# EAGLE design aspirin (EAGLE 6.1)
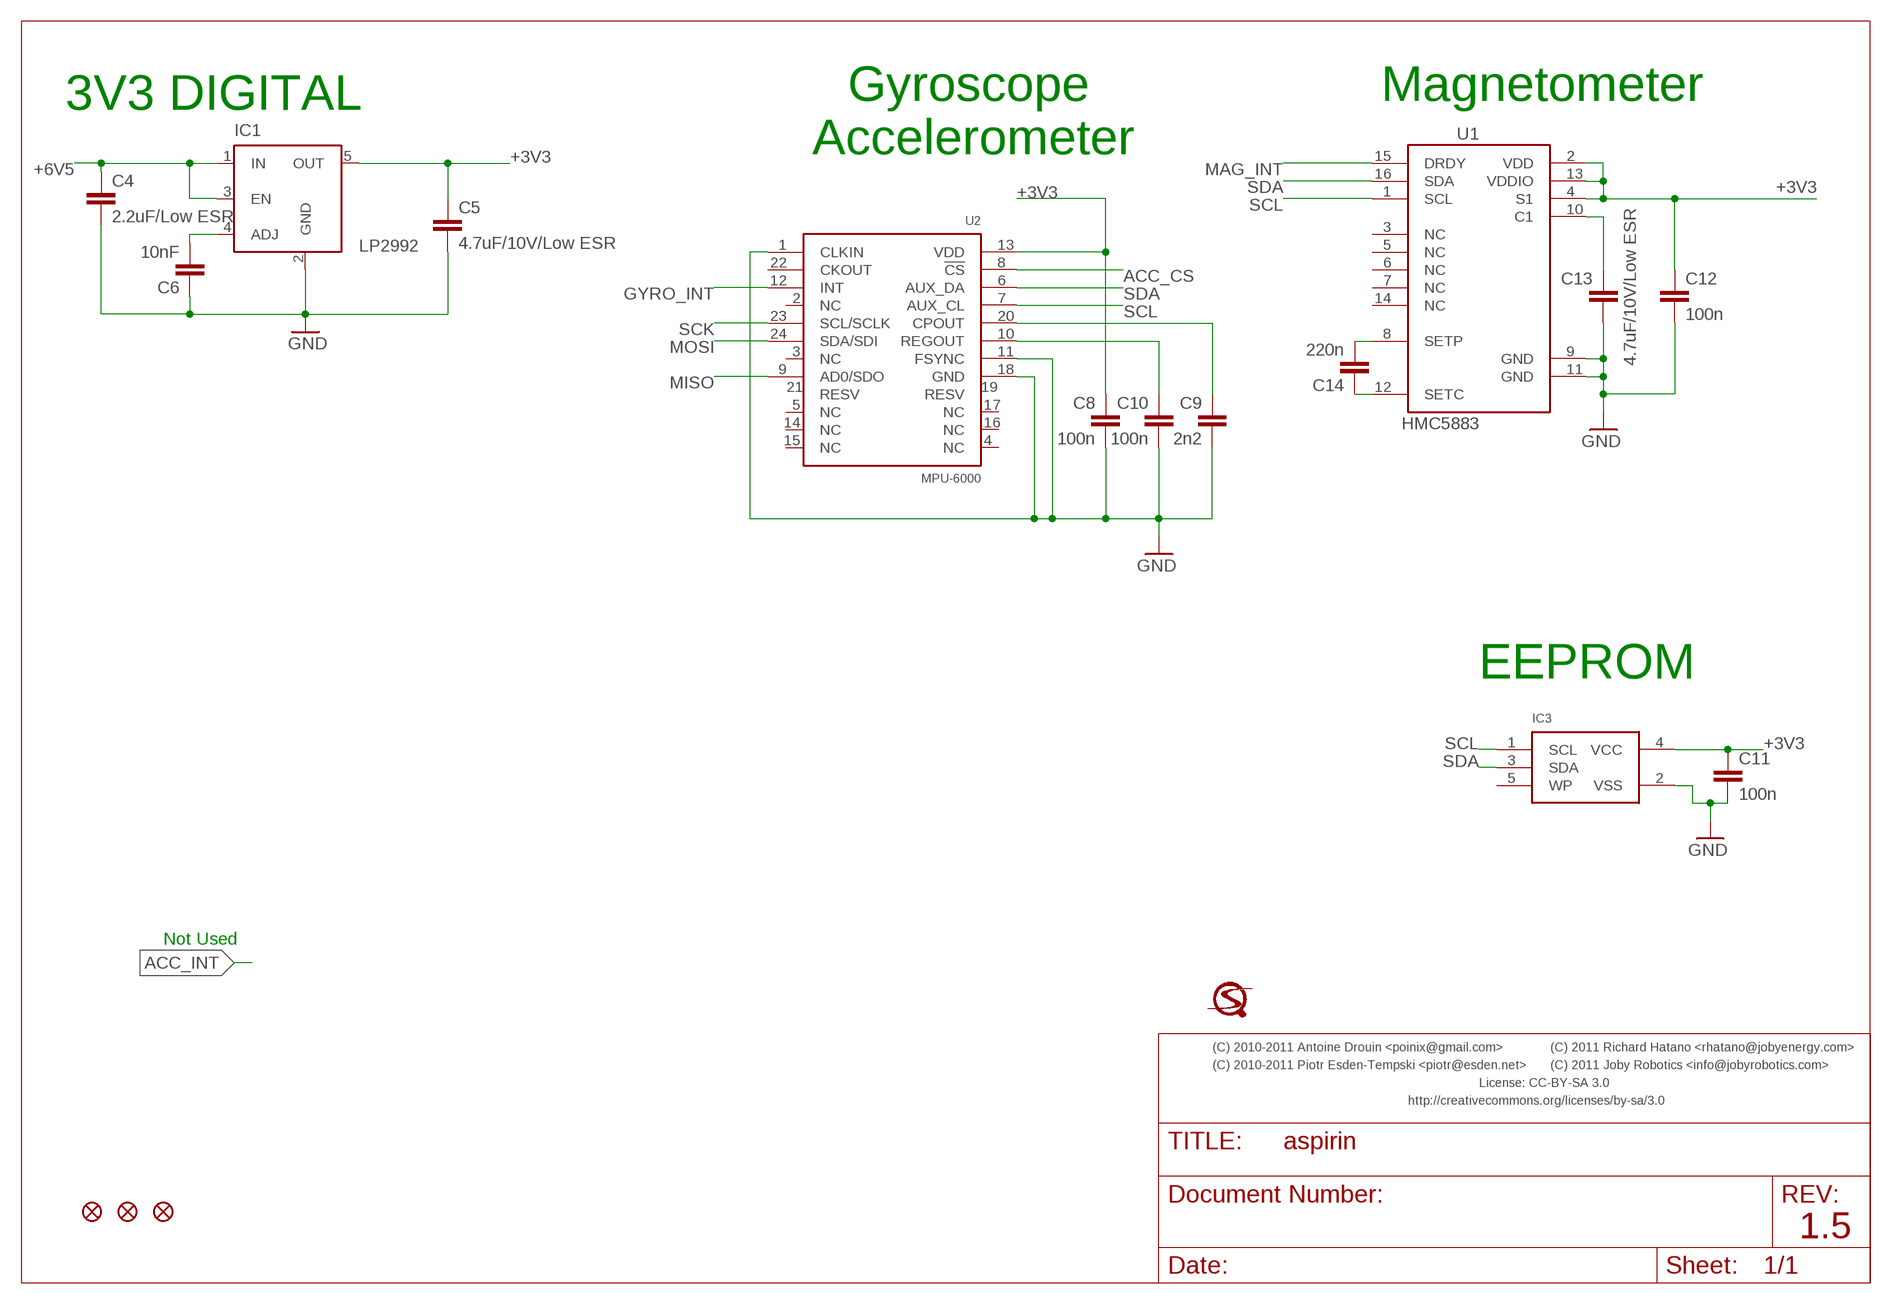
[diagram p0: schematic, sheet 1]

## Parts
C4  2.2uF/Low ESR  CAPACITOR-0603  [0603-CAP]
C5  4.7uF/10V/Low ESR  CAPACITOR-0402  [0402-CAP]
C6  10nF  CAPACITOR-0402  [0402-CAP]
C8  100n  CAPACITOR-0402  [0402-CAP]
C9  2n2  CAPACITOR-0402  [0402-CAP]
C10  100n  CAPACITOR-0402  [0402-CAP]
C11  100n  CAPACITOR-0402  [0402-CAP]
C12  100n  CAPACITOR-0402  [0402-CAP]
C13  4.7uF/10V/Low ESR  CAPACITOR-0402  [0402-CAP]
C14  220n  CAPACITOR-0402  [0402-CAP]
IC1  LP2992  MIC5219BM5  [SOT23-5]
IC3  I2C_EEPROM-SOT23-5  [SOT23-5]
JP1  FIDUCIAL1X2  [FIDUCIAL-1X2]
JP2  FIDUCIAL1X2  [FIDUCIAL-1X2]
JP3  FIDUCIAL1X2  [FIDUCIAL-1X2]
U1  HMC5883  [PLCC16-HMC5883]
U2  MPU-6000  [QFN24-NO-PAD]
U$2  LOGO  [LOGO]

## Nets
+3V3: C5.P$1 C8.P$1 C11.P$1 C12.P$1 IC1.5(OUT) IC3.4(VCC) U1.2(VDD) U1.4(S1) U1.13(VDDIO) U2.13(VDD)
+6V5: C4.P$1 IC1.1(IN) IC1.3(EN)
ACC_CS: U2.8(!CS)
GND: C4.P$2 C5.P$2 C6.P$1 C8.P$2 C9.P$2 C10.P$2 C11.P$2 C12.P$2 C13.P$2 IC1.2(GND) IC3.2(VSS) U1.9(GND) U1.11(GND) U2.1(CLKIN) U2.11(FSYNC) U2.18(GND)
GYRO_INT: U2.12(INT)
MAG_INT: U1.15(DRDY)
MISO: U2.9(AD0/SDO)
MOSI: U2.24(SDA/SDI)
N$1: C9.P$1 U2.20(CPOUT)
N$2: C10.P$1 U2.10(REGOUT)
N$3: C13.P$1 U1.10(C1)
N$19: C6.P$2 IC1.4(ADJ)
N$34: C14.P$2 U1.8(SETP)
N$48: C14.P$1 U1.12(SETC)
SCK: U2.23(SCL/SCLK)
SCL: IC3.1(SCL) U1.1(SCL) U2.7(AUX_CL)
SDA: IC3.3(SDA) U1.16(SDA) U2.6(AUX_DA)
Unconnected: IC3.5(WP) U1.3(NC) U1.5(NC) U1.6(NC) U1.7(NC) U1.14(NC) U2.2(NC) U2.3(NC) U2.4(NC) U2.5(NC) U2.14(NC) U2.15(NC) U2.16(NC) U2.17(NC) U2.19(RESV) U2.21(RESV) U2.22(CKOUT)

## Notes on the sheet
- 3V3 DIGITAL | Gyroscope | Magnetometer
- Accelerometer
- EEPROM
- Not Used
- (C) 2010-2011 Antoine Drouin <poinix@gmail.com> | (C) 2011 Richard Hatano <rhatano@jobyenergy.com>
- (C) 2010-2011 Piotr Esden-Tempski <piotr@esden.net> | (C) 2011 Joby Robotics <info@jobyrobotics.com>
- License: CC-BY-SA 3.0
- http://creativecommons.org/licenses/by-sa/3.0
- 1.5

## Library data of the parts
C4-C6 C8-C14 = pel_dipol_comp:CAPACITOR
IC1 = v-reg-micrel:MIC5219BM5: VOLTAGE REGULATOR
IC3 = aspirin:I2C_EEPROM
JP1-JP3 = aspirin:FIDUCIAL: Fiducial Alignment Points Various fiducial points for machine vision alignment.
U1 = aspirin:HMC5883
U2 = aspirin:MPU-6000
U$2 = quadshot:LOGO

## Board
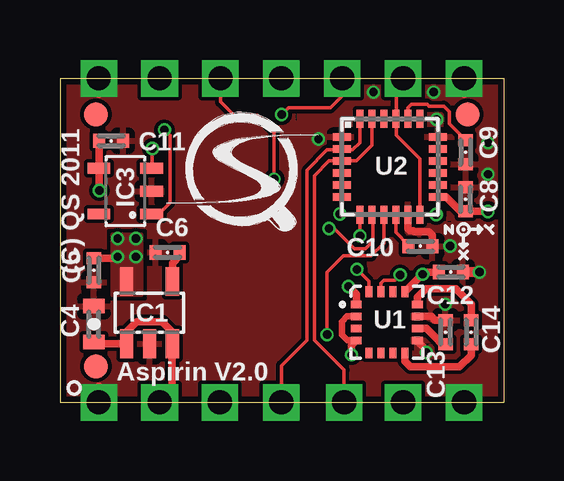
[diagram p1: board, top side]
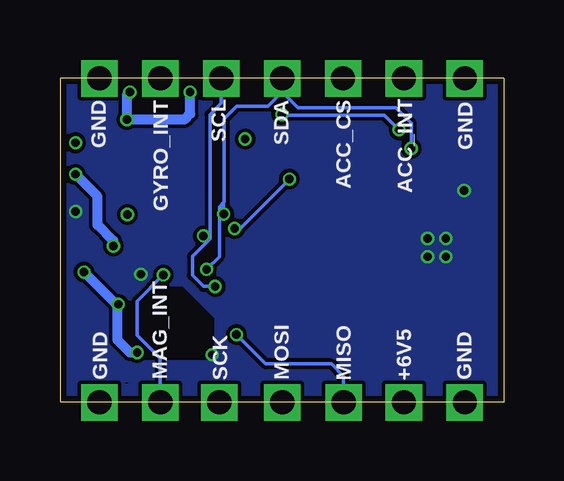
[diagram p2: board, bottom side, seen from below]

Size 18.5 x 13.5 mm. Coordinates in mm from the lower left corner, seen from the top.
Outline: 0,13.5 0,0 18.5,0 18.5,13.5 0,13.5
Copper layers (1*2+15*16): Top 0.035mm / dielectric 0.2mm / Route2 0.035mm / dielectric 1.5mm / Route15 0.035mm / dielectric 0.2mm / Bottom 0.035mm
Design rules: minimum track width 0.15mm, minimum drill 0.35mm, track to track 6mil, track to pad 6mil, pad to pad 6mil, via to via 6mil, smd to smd 6mil, copper to edge 10mil, drill to drill 8mil, minimum pad ring 0.1mm, minimum via ring 0.1mm, stop-mask expansion 4mil, vias tented up to drill 0.35mm, thermal gap 10mil
tRestrict: area 16.2,7.5 to 16.3,7.5; area 12.3,8.4 to 15.2,11.2; area 9.8,11.8 to 9.9,11.9; area 12.7,2.3 to 14.6,4.3
bRestrict: area 15.7,0.8 to 15.8,0.8; area 12.1,1.8 to 15,4.7
vRestrict: area 12.7,2.3 to 14.6,4.3

### Footprints (pad centres in the part's own frame; a part is rotated, then mirrored left to right if it is on the bottom)
0603-CAP = smd 0.6 x 0.9: P$1 -0.75,0; P$2 0.75,0
0402-CAP = smd 0.5 x 0.6: P$1 -0.5,0; P$2 0.5,0
SOT23-5 = smd 0.55 x 1.2: 1 -0.95,-1.3; 2 0,-1.3; 3 0.95,-1.3; 4 0.95,1.3; 5 -0.95,1.3
SOT23-5' = smd 0.45 x 0.95: 1 0.95,1.1; 2 0,1.1; 3 -0.95,1.1; 4 -0.95,-1.1; 5 0.95,-1.1
FIDUCIAL-1X2 = smd 1 x 1: 1 0,0
PLCC16-HMC5883 = smd 0.45 x 0.3: 1 -1.275,0.75; 2 -1.275,0.25; 3 -1.275,-0.25; 4 -1.275,-0.75; 9 1.275,-0.75; 10 1.275,-0.25; 11 1.275,0.25; 12 1.275,0.75 | smd 0.3 x 0.45: 5 -0.75,-1.275; 6 -0.25,-1.275; 7 0.25,-1.275; 8 0.75,-1.275; 13 0.75,1.275; 14 0.25,1.275; 15 -0.25,1.275; 16 -0.75,1.275
QFN24-NO-PAD = smd 0.75 x 0.3: 1 -2,1.25; 2 -2,0.75; 3 -2,0.25; 4 -2,-0.25; 5 -2,-0.75; 6 -2,-1.25; 13 2,-1.25; 14 2,-0.75; 15 2,-0.25; 16 2,0.25; 17 2,0.75; 18 2,1.25 | smd 0.3 x 0.75: 7 -1.25,-2; 8 -0.75,-2; 9 -0.25,-2; 10 0.25,-2; 11 0.75,-2; 12 1.25,-2; 19 1.25,2; 20 0.75,2; 21 0.25,2; 22 -0.25,2; 23 -0.75,2; 24 -1.25,2

### Placement (x,y rotation side)
C4  1.42,3.26 90 top
C5  1.42,5.49 270 top
C6  4.5,6.25 0 top
C8  16.92,8.47 90 top
C9  16.92,10.42 270 top
C10  15.04,6.5 0 top
C11  2.13,10.9 0 top
C12  16.31,5.43 0 top
C13  16.08,2.93 90 top
C14  17.15,2.93 270 top
DRILEGEND  [DRILEGEND]  -1.02,-7.68 0 top  (outside the outline)
IC1  3.73,3.73 0 top
IC3  [SOT23-5']  2.73,8.8 270 top
JP1  1.5,12 0 top
JP2  17,12 0 top
JP3  1.5,1.5 0 top
U1  13.63,3.33 0 top
U2  13.76,9.8 0 top
U$2  7.64,9.75 0 top

### Tracks (layer width: path | path; a pad name or v marks a point on that pad's centre or on a via)
+3V3  (via drill 0.35)
  Top 0.279: U1.2 11.98,3.58 11.75,3.35 11.75,2.82 11.99,2.58 U1.4
  Top 0.305: v1.64,8.82 1.64,9.73 IC3.4 1.63,10.89 C11.P$1 | C5.P$1 2.34,5.99 v2.41,6.06 | 14.39,4.61 U1.13 15.11,5.33 v15.13,5.33 15.22,5.42 C12.P$1 | v12.16,1.98 12.16,2.38 U1.4 | U2.13 16.1,8.55 16.69,7.97 C8.P$1 17.83,7.97 v17.85,7.95
  other vias: 3.17,6.06 2.41,6.83 3.17,6.83
  pour Top (no thermals): 3.4,4.46 2.18,4.46 2.18,7 3.4,7
  pour Bottom (rank 6): 0,0 18.5,0 18.5,13.5 0,13.5
+6V5  (via drill 1.02)
  Top 0.305: v4.16,0 4.68,0.53 IC1.3 4.68,2.94 4.27,3.35 3.2,3.35 2.78,2.94 IC1.1 1.49,2.43 C4.P$1
ACC_CS  (via drill 0.35, 1.02)
  Top 0.152: v8.93,9.3 8.93,11.27 8.23,11.96 7.26,11.96 6.7,12.52 v6.7,13.5 | U2.8 13.05,7.77 13.05,6.71 12.74,6.4 12.28,6.4 11.45,7.24 v11.22,7.24
  Bottom 0.152: v8.93,9.3 10.99,7.24 v11.22,7.24
ACC_INT  (via drill 1.02)
  other vias: 4.16,13.5
GND  (via drill 0.35, 1.02)
  Top 0.305: U2.11 14.51,7.23 14.6,7.14 14.75,7.14 14.77,7.11 15.38,7.11 15.54,6.96 C10.P$2 | U1.9 14.91,2.54 15.28,2.16 15.28,2.08 | U1.11 15.49,3.58 15.64,3.43 C13.P$2
  Top 0.406: C12.P$2 v17.49,5.42 | v1.62,13.5 1.62,12.88 | v16.86,13.5 16.86,12.88 | v1.62,0 1.62,0.61
  Bottom 0.406: v17.49,5.42 16.15,4.08 v16.07,4.08 16.09,4.06 16.09,2.59 15.57,2.07 v15.28,2.07 | v15.59,12.92 15.71,12.8 v15.71,11.78 13.31,11.78 13.07,12.01 v13.07,12.92 | v16.27,6.51 16.27,6.73 16.93,7.39 16.93,8.59 v17.85,9.5
  other vias: 17.85,10.81 16.86,0 10.78,10.97
  pour Top (rank 6): 0,0 18.5,0 18.5,13.5 0,13.5
GYRO_INT  (via drill 0.35, 1.02)
  Top 0.152: v15.69,7.82 15.67,7.8 U2.12 15.01,10.15 14.04,11.12 14.04,13.22 v14.32,13.5
MAG_INT  (via drill 0.35, 1.02)
  Top 0.152: U1.15 13.38,4.96 13.5,5.08 13.96,5.08 v14.19,5.31
  Bottom 0.152: v14.19,5.31 15.28,4.22 15.28,2.79 14.32,1.83 v14.32,0
MISO  (via drill 0.35, 1.02)
  Top 0.152: U2.9 13.51,6.63 12.97,6.1 11.83,6.1 11.14,5.41 v11.14,2.82
  Bottom 0.152: v6.67,0 6.67,1.09 7.18,1.6 9.92,1.6 v11.14,2.82
MOSI  (via drill 1.02)
  Top 0.152: U2.24 12.51,10.82 12.21,10.52 11.14,10.52 10.3,9.68 10.3,2.59 9.24,1.52 v9.24,0
N$1
  Top 0.152: C9.P$1 16.23,11.61 16.23,12.12 16,12.34 15.39,12.34 15.32,12.42 14.66,12.42 14.51,12.27 U2.20
N$2
  Top 0.152: U2.10 14.01,7.08 14.54,6.55 C10.P$1
N$3
  Top 0.305: U1.10 15.28,3.08 15.46,2.9 15.61,2.74 15.93,2.43 C13.P$1
N$19
  Top 0.305: C6.P$2 5,6.1 4.69,5.79 IC1.4
N$34
  Top 0.305: C14.P$2 17.15,1.97 16.65,1.47 14.62,1.47 14.38,1.71 U1.8
N$48
  Top 0.305: C14.P$1 17.15,4.08 16.5,4.72 15.26,4.72 14.91,4.37 U1.12
SCK  (via drill 1.02)
  Top 0.152: U2.23 13.01,10.71 12.36,10.06 11.22,10.06 10.61,9.45 10.61,2.59 11.85,1.35 v11.85,0
SCL  (via drill 0.35, 1.02)
  Top 0.152: IC3.1 4.13,7.84 4.59,8.31 4.59,11.12 v4.36,11.35 | v11.78,13.5 11.78,12.77 11.28,12.27 9.53,12.27 v9.25,11.99 | U1.1 | U2.7 v12.51,6.94 v12.51,6.93
  Top 0.305: U1.1 12.36,4.5 v12.03,4.83
  Bottom 0.152: 12.24,6.81 12.24,11.99 11.78,12.46 v11.78,13.5 | v4.36,11.35 4.97,11.96 9.22,11.96 v9.25,11.99 | 12.24,6.81 12.97,6.08 12.97,5.28 12.51,4.83 v12.03,4.83 | 12.24,6.81 12.39,6.81 v12.51,6.93
SDA  (via drill 0.35, 1.02)
  Top 0.152: IC3.3 3.85,9.77 v3.85,10.57 | U1.16 12.88,5.04 v12.39,5.54 | U2.6 11.76,7.93 v11.67,7.85
  Bottom 0.152: v3.85,10.57 3.85,11.63 4.5,12.27 8.57,12.27 9.24,12.94 | v12.39,5.54 11.85,6.07 11.85,8.15 11.67,8.33 | 9.24,12.94 9.83,12.34 11.13,12.34 11.66,11.81 11.65,11.8 11.65,8.36 11.67,8.33 | 9.24,12.94 v9.24,13.5 | 11.67,8.33 v11.67,7.85

### Text on the board
tPlace: (C) QS 2011 | Aspirin V2.0
bPlace: GND | ACC_INT | ACC_CS | SDA | SCL | GYRO_INT | GND | GND | +6V5 | MISO | MOSI | SCK | MAG_INT | GND